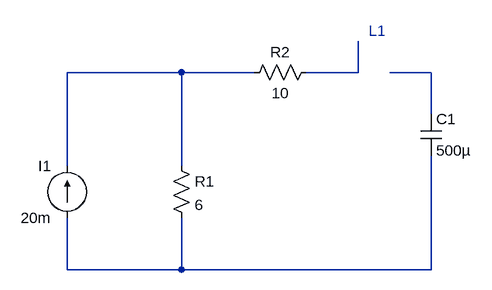
[diagram p0: schematic EJ2_teoría.asc]
EJ2_teoría.asc, the LTspice schematic file:
Version 4.1
SHEET 1 920 680
WIRE 288 -80 112 -80
WIRE 400 -80 288 -80
WIRE 560 -80 560 -128
WIRE 560 -80 480 -80
WIRE 672 -80 608 -80
WIRE 672 -16 672 -80
WIRE 112 64 112 -80
WIRE 288 64 288 -80
WIRE 112 224 112 144
WIRE 288 224 288 144
WIRE 288 224 112 224
WIRE 672 224 672 48
WIRE 672 224 288 224
SYMBOL res 272 48 R0
SYMATTR InstName R1
SYMATTR Value 6
SYMBOL current 112 144 R180
WINDOW 0 24 80 Left 2
WINDOW 3 24 0 Left 2
SYMATTR InstName I1
SYMATTR Value 20m
SYMBOL res 496 -96 R90
WINDOW 0 0 56 VBottom 2
WINDOW 3 32 56 VTop 2
SYMATTR InstName R2
SYMATTR Value 10
SYMBOL cap 656 -16 R0
SYMATTR InstName C1
SYMATTR Value 500µ
TEXT 576 -144 Left 2 ;L1

The netlist it stands for:
* EJ2_teoría.asc
R1 N001 N004 6
I1 N004 N001 20m
R2 N002 N001 10
C1 N003 N004 500µ
* L1
.backanno
.end